# EAGLE schematic anemo5 (EAGLE 6.6.0)
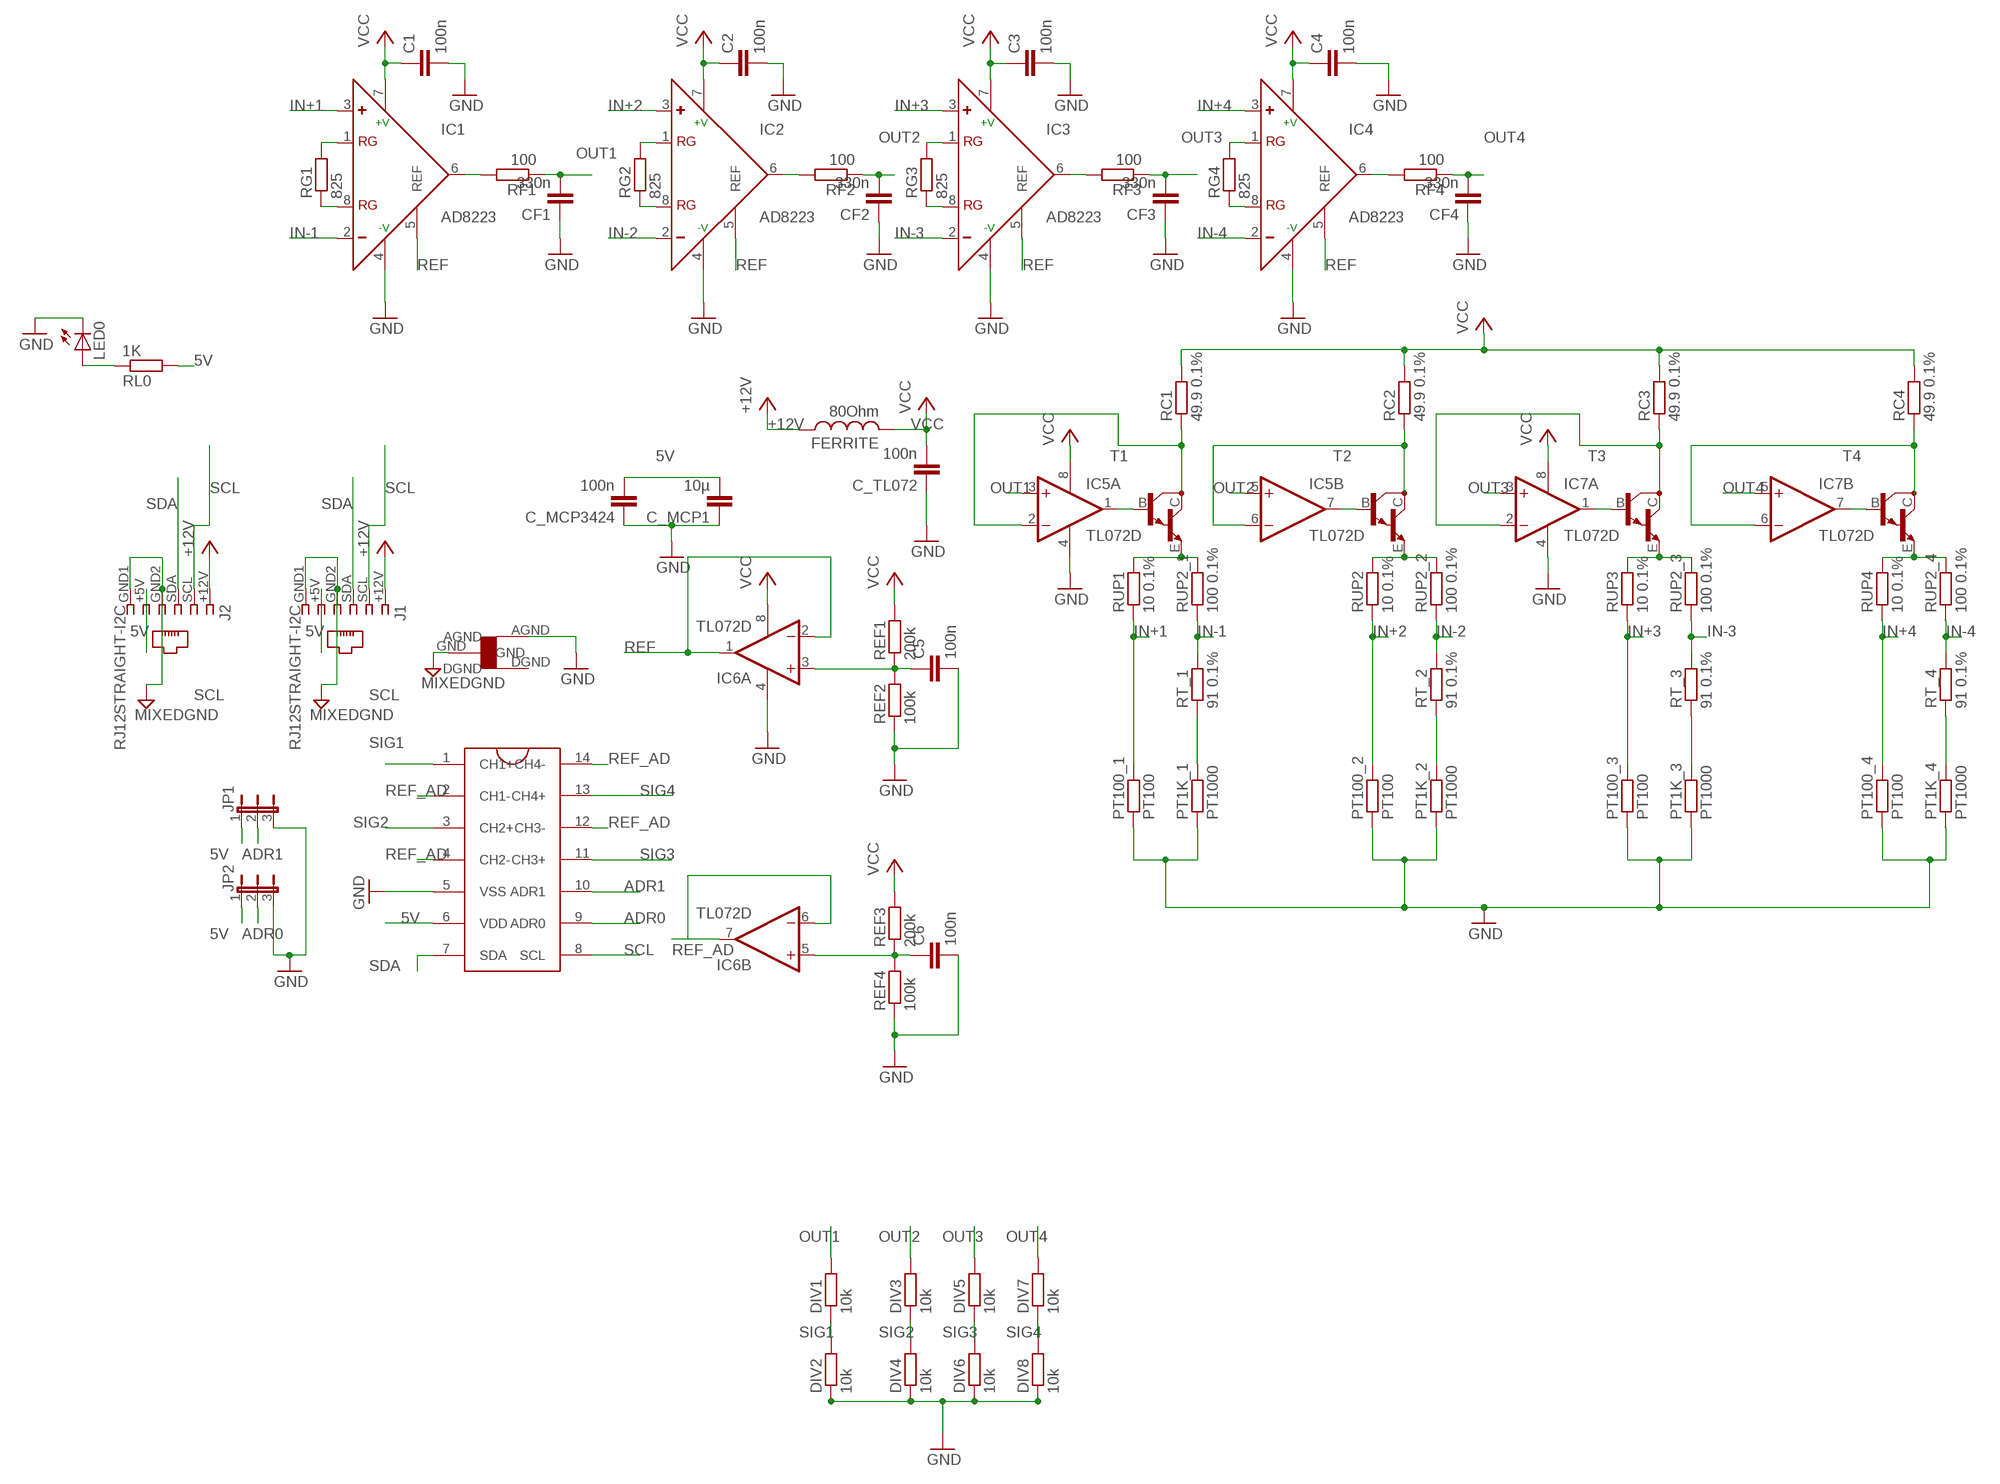
[diagram p0: schematic, sheet 1]

## Parts
C1  100n  C-EUC1206  [C1206]
C2  100n  C-EUC1206  [C1206]
C3  100n  C-EUC1206  [C1206]
C4  100n  C-EUC1206  [C1206]
C5  100n  C-EUC1206  [C1206]
C6  100n  C-EUC1206  [C1206]
C_MCP1  10µ  C-EUC1206  [C1206]
C_MCP3424  100n  C-EUC1206  [C1206]
C_TL072  100n  C-EUC1206  [C1206]
CF1  330n  C-EUC1206  [C1206]
CF2  330n  C-EUC1206  [C1206]
CF3  330n  C-EUC1206  [C1206]
CF4  330n  C-EUC1206  [C1206]
DIV1  10k  R-EU_M1206  [M1206]
DIV2  10k  R-EU_M1206  [M1206]
DIV3  10k  R-EU_M1206  [M1206]
DIV4  10k  R-EU_M1206  [M1206]
DIV5  10k  R-EU_M1206  [M1206]
DIV6  10k  R-EU_M1206  [M1206]
DIV7  10k  R-EU_M1206  [M1206]
DIV8  10k  R-EU_M1206  [M1206]
FERRITE  80Ohm  L-USL3216C  [L3216C]
IC1  AD8223  AD620R  [SO8]
IC2  AD8223  AD620R  [SO8]
IC3  AD8223  AD620R  [SO8]
IC4  AD8223  AD620R  [SO8]
IC5  TL072D  [SO08]
IC6  TL072D  [SO08]
IC7  TL072D  [SO08]
J1  RJ12STRAIGHT-I2C  [RJ12-STRAIGHT-I2C]
J2  RJ12STRAIGHT-I2C  [RJ12-STRAIGHT-I2C]
JP1  JP2E  [JP2]
JP2  JP2E  [JP2]
LED0  LED1206  [LED-1206]
PT1K_1  PT1000  R-EU_M1206  [M1206]
PT1K_2  PT1000  R-EU_M1206  [M1206]
PT1K_3  PT1000  R-EU_M1206  [M1206]
PT1K_4  PT1000  R-EU_M1206  [M1206]
PT100_1  PT100  R-EU_M1206  [M1206]
PT100_2  PT100  R-EU_M1206  [M1206]
PT100_3  PT100  R-EU_M1206  [M1206]
PT100_4  PT100  R-EU_M1206  [M1206]
RC1  49.9 0.1%  R-EU_M1206  [M1206]
RC2  49.9 0.1%  R-EU_M1206  [M1206]
RC3  49.9 0.1%  R-EU_M1206  [M1206]
RC4  49.9 0.1%  R-EU_M1206  [M1206]
REF1  200k  R-EU_M1206  [M1206]
REF2  100k  R-EU_M1206  [M1206]
REF3  200k  R-EU_M1206  [M1206]
REF4  100k  R-EU_M1206  [M1206]
RF1  100  R-EU_M1206  [M1206]
RF2  100  R-EU_M1206  [M1206]
RF3  100  R-EU_M1206  [M1206]
RF4  100  R-EU_M1206  [M1206]
RG1  825  R-EU_M1206  [M1206]
RG2  825  R-EU_M1206  [M1206]
RG3  825  R-EU_M1206  [M1206]
RG4  825  R-EU_M1206  [M1206]
RL0  1K  R-EU_M1206  [M1206]
RT_1  91 0.1%  R-EU_M1206  [M1206]
RT_2  91 0.1%  R-EU_M1206  [M1206]
RT_3  91 0.1%  R-EU_M1206  [M1206]
RT_4  91 0.1%  R-EU_M1206  [M1206]
RUP1  10 0.1%  R-EU_M1206  [M1206]
RUP2  10 0.1%  R-EU_M1206  [M1206]
RUP2_1  100 0.1%  R-EU_M1206  [M1206]
RUP2_2  100 0.1%  R-EU_M1206  [M1206]
RUP2_3  100 0.1%  R-EU_M1206  [M1206]
RUP2_4  100 0.1%  R-EU_M1206  [M1206]
RUP3  10 0.1%  R-EU_M1206  [M1206]
RUP4  10 0.1%  R-EU_M1206  [M1206]
T1  MMBTA13LT1-NPN_DARL-SOT23-BEC  [SOT23-BEC]
T2  MMBTA13LT1-NPN_DARL-SOT23-BEC  [SOT23-BEC]
T3  MMBTA13LT1-NPN_DARL-SOT23-BEC  [SOT23-BEC]
T4  MMBTA13LT1-NPN_DARL-SOT23-BEC  [SOT23-BEC]
U$1  MCP3424(SO14)  [14LDSOIC]
U$2  STARGND  [STAR]

## Nets
5V: C_MCP1.2 C_MCP3424.2 J1.+5V J2.+5V JP1.1 JP2.1 RL0.2 U$1.6(VDD)
+12V: FERRITE.1 J1.+12V J2.+12V
ADR0: JP2.2 U$1.9(ADR0)
ADR1: JP1.2 U$1.10(ADR1)
GND [gnd]: C1.2 C2.2 C3.2 C4.2 C5.2 C6.2 C_MCP1.1 C_MCP3424.1 C_TL072.1 CF1.1 CF2.1 CF3.1 CF4.1 DIV2.1 DIV4.1 DIV6.1 DIV8.1 IC1.4(-V) IC2.4(-V) IC3.4(-V) IC4.4(-V) IC5.4(P:V-) IC6.4(P:V-) IC7.4(P:V-) JP1.3 JP2.3 LED0.C PT1K_1.1 PT1K_2.1 PT1K_3.1 PT1K_4.1 PT100_1.1 PT100_2.1 PT100_3.1 PT100_4.1 REF2.1 REF4.1 U$1.5(VSS) U$2.AGND
IN+1: IC1.3(+) PT100_1.2 RUP1.1
IN+2: IC2.3(+) PT100_2.2 RUP2.1
IN+3: IC3.3(+) PT100_3.2 RUP3.1
IN+4: IC4.3(+) PT100_4.2 RUP4.1
IN-1: IC1.2(-) RT_1.2 RUP2_1.1
IN-2: IC2.2(-) RT_2.2 RUP2_2.1
IN-3: IC3.2(-) RT_3.2 RUP2_3.1
IN-4: IC4.2(-) RT_4.2 RUP2_4.1
MIXEDGND [gnd]: J1.GND1 J1.GND2 J2.GND1 J2.GND2 U$2.GND
N$1: IC1.1(RG) RG1.2
N$2: IC1.8(RG) RG1.1
N$3: IC2.8(RG) RG2.1
N$4: IC2.1(RG) RG2.2
N$5: IC3.1(RG) RG3.2
N$6: IC3.8(RG) RG3.1
N$7: IC4.1(RG) RG4.2
N$8: IC4.8(RG) RG4.1
N$9: RUP1.2 RUP2_1.2 T1.E
N$10: C5.1 IC6.3(A:+IN) REF1.1 REF2.2
N$11: RUP2.2 RUP2_2.2 T2.E
N$12: RUP2_3.2 RUP3.2 T3.E
N$13: RUP2_4.2 RUP4.2 T4.E
N$14: LED0.A RL0.1
N$15 [highpower]: IC5.2(A:-IN) RC1.1 T1.C
N$16 [highpower]: IC5.6(B:-IN) RC2.1 T2.C
N$17 [highpower]: IC7.2(A:-IN) RC3.1 T3.C
N$18: IC1.6(OUT) RF1.2
N$19: IC2.6(OUT) RF2.2
N$20: IC3.6(OUT) RF3.2
N$21: IC4.6(OUT) RF4.2
N$22 [highpower]: IC7.6(B:-IN) RC4.1 T4.C
N$23: PT1K_1.2 RT_1.1
N$24: C6.1 REF3.1 REF4.2
N$25: PT1K_2.2 RT_2.1
N$27: PT1K_3.2 RT_3.1
N$29: PT1K_4.2 RT_4.1
OUT1: CF1.2 DIV1.2 IC5.3(A:+IN) RF1.1
OUT1A: IC5.1(A:OUT) T1.B
OUT2: CF2.2 DIV3.2 IC5.5(B:+IN) RF2.1
OUT2A: IC5.7(B:OUT) T2.B
OUT3: CF3.2 DIV5.2 IC7.3(A:+IN) RF3.1
OUT3A: IC7.1(A:OUT) T3.B
OUT4: CF4.2 DIV7.2 IC7.5(B:+IN) RF4.1
OUT4A: IC7.7(B:OUT) T4.B
REF: IC1.5(REF) IC2.5(REF) IC3.5(REF) IC4.5(REF) IC6.1(A:OUT) IC6.2(A:-IN)
REF_AD: IC6.6(B:-IN) IC6.7(B:OUT) U$1.2(CH1-) U$1.4(CH2-) U$1.12(CH3-) U$1.14(CH4-)
SCL: J1.SCL J2.SCL U$1.8(SCL)
SDA: J1.SDA J2.SDA U$1.7(SDA)
SIG1: DIV1.1 DIV2.2 U$1.1(CH1+)
SIG2: DIV3.1 DIV4.2 U$1.3(CH2+)
SIG3: DIV5.1 DIV6.2 U$1.11(CH3+)
SIG4: DIV7.1 DIV8.2 U$1.13(CH4+)
VCC [highpower]: C1.1 C2.1 C3.1 C4.1 C_TL072.2 FERRITE.2 IC1.7(+V) IC2.7(+V) IC3.7(+V) IC4.7(+V) IC5.8(P:V+) IC6.8(P:V+) IC7.8(P:V+) RC1.2 RC2.2 RC3.2 RC4.2 REF1.2 REF3.2
Unconnected: IC6.5(B:+IN) U$2.DGND

## Library data of the parts
C1-C6 C_MCP1 C_MCP3424 C_TL072 CF1-CF4 = rcl:C-EU: CAPACITOR, European symbol
DIV1-DIV8 PT1K_1-PT1K_4 PT100_1-PT100_4 RC1-RC4 REF1-REF4 RF1-RF4 RG1-RG4 RL0 RT_1-RT_4 RUP1 RUP2 RUP2_1-RUP2_4 RUP3 RUP4 = resistor:R-EU_: RESISTOR, European symbol
FERRITE = rcl:L-US: INDUCTOR, American symbol
IC1-IC4 = analog-devices:AD620: Low Cost, Low Power, Instrumentation Amplifier Source: http://www.analog.com/UploadedFiles/Data_Sheets/37793330023930AD620_e.pdf; MPN: AD620AR; OC_FARNELL: 1464424; OC_NEWARK: 05F7109
IC5-IC7 = linear:TL072: OP AMP
J1 J2 = lpatiny:RJ12: CORCOM Modular RJ Jacks No Shield Source: www.tycoelectronics.com .. ENG_DS_1654001_1099_RJ_L_0507.pdf
JP1 JP2 = jumper:JP2E: JUMPER
LED0 = SparkFun:LED: LEDs Standard schematic elements and footprints for 5mm, 3mm, 1206, and 0603 sized LEDs. 5mm - Spark Fun Electronics SKU : COM-00529 (and others)
T1-T4 = transistor:*-NPN_DARL-: NPN Darlington Transistor
U$1 = mcp3424:MCP3424(SO14)
U$2 = lpatiny:STARGND

## Net classes
0 default: width 0.61 mm
1 gnd: width 0.61 mm
2 highpower: width 0.813 mm